# Altium schematic sheet 0805W8F200JT5E.schdoc
size 127 x 101 mm
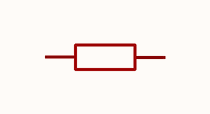
[diagram p0: 0805W8F200JT5E.schdoc]

## Parts
R?  0805w8f200jt5e  [R0805]  (value not drawn)

## Nets

Not connected (* = marked no-connect by the designer): R? 1 2

## Library data of the parts
R? = 0805w8f200jt5e: 电阻类型:厚膜电阻;阻值:20Ω;精度:±1%;功率:125mW;工作电压:150V;温度系数:±100ppm/℃;; Manufacturer: UNI-ROYAL(厚声); AddInBom: yes; ModelId: 37a81e68749a4138bd2dfa6897b24b85; ModelName: R0805_L2.0-W1.3-H0.6; ModelTransform: 78.74,51.181,0,0,0,0,0,-0.0005,0; Value: 20Ω; Tolerance: ±1%; Power(Watts): 125mW; Voltage-Supply(Max): 150V; Symbol: 0805W8F200JT5E; LCSC Part Name: 20Ω ±1% 125mW 厚膜电阻; SupplierPart: C17544; ManufacturerPart: 0805W8F200JT5E; Supplier Footprint: 0805; JLCPCB Part Class: Basic Part; Datasheet: https://item.szlcsc.com/datasheet/0805W8F200JT5E/18232.html; Supplier: LCSC; ConvertToPcb: yes; FootprintName: R0805; Type: 厚膜电阻; Temperature Coefficient: ±100ppm/℃; Operating Temperature: -55℃~+155℃